# Altium schematic sheet driver2.SchDoc
size A; SheetNumber: 6; SheetTotal: 10
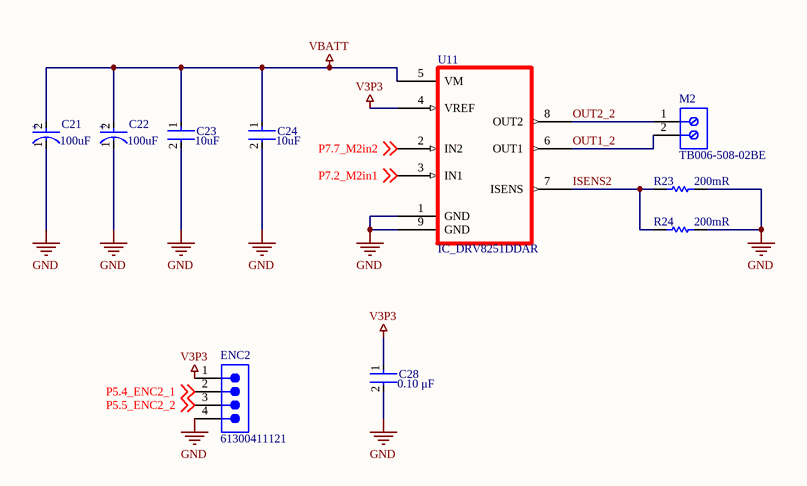
[diagram p0: driver2.SchDoc]

## Parts
C21  value 100uF  [FP-SD8-MFG]  (hidden comment: EEE-1EA101XP)
C22  value 100uF  [FP-SD8-MFG]  (hidden comment: EEE-1EA101XP)
C23  value 10uF  [FP-C0805C-DG-MFG]  (hidden comment: C0805C106K8PACTU)
C24  value 10uF  [FP-C0805C-DG-MFG]  (hidden comment: C0805C106K8PACTU)
C28  Capacitance: 0.10 μF  [FP-C0805C-DN-MFG]  (hidden comment: C0805C104K5RACTU)
ENC2  61300411121  [61300411121]
M2  Manufacturer Part Number: TB006-508-02BE  [CUI_TB006 -508-02BE]  (hidden comment: CONN_TB006_-508-02BE)
R23  value 200mR  [RESC2013X60X40LL20T25]  (hidden comment: 0.2R)
R24  value 200mR  [RESC2013X60X40LL20T25]  (hidden comment: 0.2R)
U11  IC_DRV8251DDAR  [SOIC_8_PP]

## Nets
GND: C21.1(C) C22.1(C) C23.2 C24.2 C28.2 ENC2.4 R23.1 R24.1 U11.1(GND) U11.9(GND)
V3P3: C28.1 ENC2.1 U11.4(VREF)
VBATT: C21.2(A) C22.2(A) C23.1 C24.1 U11.5(VM)
ISENS2: R23.2 R24.2 U11.7(ISENS)
OUT1_2: M2.2 U11.6(OUT1)
OUT2_2: M2.1 U11.8(OUT2)
P5.4_ENC2_1: ENC2.2 ; off-sheet P5.4_ENC2_1
P5.5_ENC2_2: ENC2.3 ; off-sheet P5.5_ENC2_2
P7.2_M2in1: U11.3(IN1) ; off-sheet P7.2_M2in1
P7.7_M2in2: U11.2(IN2) ; off-sheet P7.7_M2in2

## Notes on the sheet
- (in symbol CMP-05427-000061-1) +

## Library data of the parts
C21 C22 = CMP-05427-000061-1: CAP ALUM 100UF 20% 25V SMD; Manufacturer: Panasonic; Leakage Current: 3uA; Life (Hours): 2000Hour; Ripple Current: 143mA; Polarity: Polar; Dissipation Factor: 14%; Height - Seated (Max): 0.303inch; Contact Plating: Tin; Max Operating Temperature: 85°C; Package Quantity: 900; RoHS Compliant: Yes; Termination: SMD/SMT; Lead Free: Lead Free; Min Operating Temperature: -40°C; Radiation Hardening: No; Length: 8mm; Height: 7.7mm; Series: S; Voltage Rating: 25V; Capacitance: 100uF; Diameter: 6.3mm; Ripple Current (AC): 143mA; Case/Package: Radial; Packaging: Tape and Reel; Voltage: 25V; Tolerance: 20%; Construction: Cylindrical; Voltage Rating (DC): 25V; Mount: Surface Mount; Supplier: Digikey; Supplier Part Number: PCE3898CT-ND; Manufacturer Part Number: EEE-1EA101XP; RoHS: Yes; Category: Aluminum Electrolytic Capacitors; Stock: 41776; Pricing: 1=0.51, 10=0.338, 50=0.2488, 100=0.2025 (USD); Mounting Technology: Surface Mount,PCB; Ratings: AEC-Q200; Reach SVHC Compliant: Unknown; ComponentLink1URL: https://datasheet.ciiva.com/30108/11aba0000ce2-30108047.pdf?src-supplier=Onlinecomponents.com; ComponentLink1Description: https://datasheet.ciiva.com/30108/11aba0000ce2-30108047.pdf?src-supplier=Onlinecomponents.com; ComponentLink2URL: https://datasheet.ciiva.com/16201/aba0000ce2-16201065.pdf?src-supplier=Future+Electronics; ComponentLink2Description: https://datasheet.ciiva.com/16201/aba0000ce2-16201065.pdf?src-supplier=Future+Electronics; ComponentLink3URL: https://datasheet.ciiva.com/24022/aba0000ce2-40801-24022875.pdf?src-supplier=Mouser; ComponentLink3Description: https://datasheet.ciiva.com/24022/aba0000ce2-40801-24022875.pdf?src-supplier=Mouser
C23 C24 = CMP-2007-03243-2: CAP CER 10UF 10V X5R 0805; Manufacturer: KEMET; Dielectric Material: Ceramic; Material: 4241ConductorMaterial; Tolerance: 10%; ComponentLink2URL: https://content.kemet.com/datasheets/KEM_C1006_X5R_SMD.pdf; ComponentLink2Description: Datasheet; Supplier: Digikey; Supplier Part Number: 399-C0805C106K8PAC7800CT-ND; Manufacturer Part Number: C0805C106K8PACTU; RoHS: Yes; Category: Ceramic Capacitors; Stock: 5202928; Pricing: 1=0.14, 10=0.098, 50=0.0584, 100=0.0459, 500=0.03388, 1000=0.02805 (USD); Mounting Technology: Surface Mount; Case/Package: 0805; Pins: 2; Contact Plating: Tin,Matte; Case Code (Imperial): 0805; Case Code (Metric): 2012; Min Operating Temperature: -55°C; Max Operating Temperature: 85°C; Packaging: Tape and Reel; Dielectric: X5R; Voltage Rating (DC): 10V; Termination: SMD/SMT; Package Quantity: 1; Voltage Rating: 10V; Voltage: 10V; Dissipation Factor: 10%; Series: C; Construction: Flat; Length: 2mm; Width: 0.049inch; Height: 1.25mm; Depth: 1.25mm; Thickness: 0.055inch; Radiation Hardening: No; Reach SVHC Compliant: No; Lead Free: Lead Free; RoHS Compliant: Yes; ComponentLink1URL: https://datasheet.ciiva.com/22704/1732709-22704859.pdf?src-supplier=Element14; ComponentLink1Description: https://datasheet.ciiva.com/22704/1732709-22704859.pdf?src-supplier=Element14; ComponentLink3URL: https://datasheet.ciiva.com/7842/1732709-7842198.pdf?src-supplier=Element14; ComponentLink3Description: https://datasheet.ciiva.com/7842/1732709-7842198.pdf?src-supplier=Element14; ComponentLink4URL: https://datasheet.ciiva.com/7842/40889-7842552.pdf?src-supplier=Element14; ComponentLink4Description: https://datasheet.ciiva.com/7842/40889-7842552.pdf?src-supplier=Element14
C28 = CMP-2007-00279-2: CAP CER 0.1UF 50V X7R 0805; Manufacturer: KEMET; Value: 0.10 μF; Tolerance: 0.1; Temperature Coefficient: 30ppm/°C; Material: Ceramic; Voltage: 500V; Manufacturer Part Number: C0805C104K5RACTU; Device Class L2: Capacitors; Temperature Range Low: -55°C; Voltage Rating: 50 V; Digikey Description: CAP CER 0.1UF 50V X7R 0805; Category: Cap; ComponentLink2Description: Datasheet; Octopart: https://octopart.com/c0805c104k5ractu-kemet-143926; RoHS: TRUE; ComponentLink2URL: https://content.kemet.com/datasheets/KEM_C1003_C0G_SMD.pdf; Temperature Characteristic: X7R; Temperature: -55°C to +125°C; Height: 0.88mm; Temperature Range High: +125°C; Device Class L1: Passive Components; Automotive: No; Lead Free: Yes; Ipc Land Pattern Name: CAPC200125X78; Device Class L3: Ceramic Capacitors; Mouser Description: Cap Ceramic 0.1uF 50V X7R 10% SMD 2.0 x 1.2 mm 125 C Paper T/R; Package: C0805C-DN; Supplier: Digikey; Supplier Part Number: 399-C0805C104K5RAC7800CT-ND; Stock: 2466194; Pricing: 1=0.14, 10=0.091, 50=0.0546, 100=0.043, 500=0.03172, 1000=0.02627 (USD); Mounting Technology: Surface Mount,PCB; Case/Package: 0805; Pins: 2; Case Code (Imperial): 0805; Case Code (Metric): 2012; Min Operating Temperature: -55°C; Max Operating Temperature: 125°C; Dielectric: X7R; Package Quantity: 4000; Packaging: Tape and Reel; Voltage Rating (DC): 50V; Termination: SMD/SMT; Series: SMD Comm X7R; Construction: Flat; Length: 2mm; Width: 1.2mm; Depth: 1.25mm; Lead Pitch: 0.75mm; Radiation Hardening: No; RoHS Compliant: Yes; Reach SVHC Compliant: No; ComponentLink1URL: https://datasheet.ciiva.com/32431/slceramic-chip-condensers-e-32431755.pdf?src-supplier=Distrelec; ComponentLink1Description: https://datasheet.ciiva.com/32431/slceramic-chip-condensers-e-32431755.pdf?src-supplier=Distrelec; ComponentLink3URL: https://datasheet.ciiva.com/28682/1851736-28682232.pdf?src-supplier=Element14; ComponentLink3Description: https://datasheet.ciiva.com/28682/1851736-28682232.pdf?src-supplier=Element14; ComponentLink4URL: https://datasheet.ciiva.com/18410/70095383-18410815.pdf?src-supplier=Allied+Electronics; ComponentLink4Description: https://datasheet.ciiva.com/18410/70095383-18410815.pdf?src-supplier=Allied+Electronics; ComponentLink5URL: https://datasheet.ciiva.com/14589/70095383-14589048.pdf?src-supplier=Allied+Electronics; ComponentLink5Description: https://datasheet.ciiva.com/14589/70095383-14589048.pdf?src-supplier=Allied+Electronics
ENC2 = CMP-1502-01064-3: NexarPartId: 32855522; Operating Supply Voltage: 250V; Pitch: 2.54mm; Contact Resistance: 20mΩ; Number of Positions: 4; Current Rating: 3A; Connector Type: Male Pin; Gender: Male; Contact Plating: Gold; Height: 8.89mm; Lead Pitch: 2.54mm; Lead Free: Lead Free; Contact Mating Length: 5.9944mm; Number of Rows: 1; Termination: Solder; Packaging: Bulk; REACH SVHC: Unknown; Min Operating Temperature: -40°C; RoHS: Compliant; Number of Contacts: 4; Voltage Rating: 250V; Color: Black; Max Operating Temperature: 105°C; Contact Material: Copper; Mount: Through Hole; Orientation: Vertical; Number of Pins: 4
M2 = CONN_TB006_-508-02BE: 2~24 Poles, Screw Type, Horizontal, 5.08 Pitch, 26~14 (AWG), Terminal Block Connector; MF: CUI Devices; MP: TB006 -508-02BE; CUI_purchase_URL: https://www.cuidevices.com/product/interconnect/connectors/terminal-blocks/tb006-508-series?utm_source=snapeda.com&utm_medium=referral&utm_campaign=snapedaBOM; Value: *; Check_prices: https://www.snapeda.com/parts/TB006%20-508-02BE/CUI+Devices/view-part/?ref=eda; SnapEDA_Link: https://www.snapeda.com/parts/TB006%20-508-02BE/CUI+Devices/view-part/?ref=snap; Availability: In Stock; Package: None; Purchase-URL: https://pricing.snapeda.com/search/part/TB006 -508-02BE/?ref=eda; Price: None; Supplier 1: Digikey; Supplier Part Number 1: 102-6191-ND; Manufacturer: CUI Devices; RoHS: Yes; Category: Terminal Blocks; Stock: 47249; Pricing: 1=0.73, 10=0.402, 25=0.3, 50=0.2676, 100=0.2623, 250=0.23084, 500=0.20984, 1000=0.18886, 5000=0.14164 (USD)
R23 R24 = CMP-2001-00628-1: RES 0.2 OHM 1% 1/2W 0805; Manufacturer: Panasonic; Manufacturer Part Number: ERJ-6DSFR20V; Max Power Dissipation: 500mW; Temperature Coefficient: 150ppm/°C; Supplier: Digikey; Supplier Part Number: P19315CT-ND; RoHS: Yes; Category: Chip SMD Resistors; Stock: 49000; Pricing: 1=0.46, 10=0.314, 25=0.2444, 50=0.18, 100=0.1253, 250=0.1092, 500=0.09004, 1000=0.06514 (USD); Case/Package: 0805; Case Code (Metric): 2012; Case Code (Imperial): 0805; Min Operating Temperature: -55°C; Max Operating Temperature: 155°C; Packaging: Cut Tape; Number of Terminations: 2; Tolerance: 1%; Features: Automotive AEC-Q200; Series: ERJ; Length: 0.079inch; Width: 0.049inch; Height: 0.028inch; ComponentLink1URL: http://www.farnell.com/datasheets/2883947.pdf?src-supplier=Newark; ComponentLink1Description: http://www.farnell.com/datasheets/2883947.pdf?src-supplier=Newark; ComponentLink2URL: https://industrial.panasonic.com/cdbs/www-data/pdf/RDN0000/AOA0000C313.pdf?src-supplier=Digikey; ComponentLink2Description: https://industrial.panasonic.com/cdbs/www-data/pdf/RDN0000/AOA0000C313.pdf?src-supplier=Digikey
U11 = IC_DRV8251DDAR: 48-V, 3.5-A H bridge motor driver with current regulation and latched OCP 8-SO PowerPAD -40 to 150; Manufacturer 1: Texas Instruments; RoHS: No; Category: Integrated Circuits (ICs); Stock: 4730; Pricing: 1=1.66, 10=1.495, 25=1.4108, 100=1.202, 250=1.12868, 500=0.9876, 1000=0.81829 (USD); Supplier 1: Digi-Key; Supplier Part Number 1: 296-DRV8251DDARCT-ND; Manufacturer Part Number 1: DRV8251DDAR